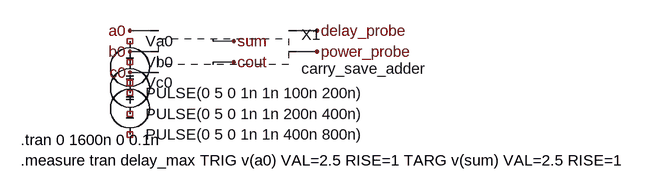
[diagram p0: schematic CARRY_SAVE_ADDER_TEST.asc]
CARRY_SAVE_ADDER_TEST.asc, the LTspice schematic file:
Version 4
SHEET 1 880 680
.lib .include "full_adder.asc"
.include "carry_save_adder.asc"
.include "ModelSp2025.txt"
* Input signals
WIRE 176 128 144 128
WIRE 176 160 144 160
WIRE 176 192 144 192
* Output probes
WIRE 304 144 272 144
WIRE 304 176 272 176
* Performance measurement points
WIRE 432 128 400 128
WIRE 432 160 400 160
FLAG 144 128 a0
FLAG 144 160 b0
FLAG 144 192 c0
FLAG 304 144 sum
FLAG 304 176 cout
FLAG 432 128 delay_probe
FLAG 432 160 power_probe
SYMBOL carry_save_adder 224 144 R0
SYMATTR InstName X1
* Input voltage sources with worst-case patterns
SYMBOL voltage 144 128 R0
WINDOW 123 0 0 Left 0
WINDOW 39 0 0 Left 0
SYMATTR InstName Va0
SYMATTR Value PULSE(0 5 0 1n 1n 100n 200n)
SYMBOL voltage 144 160 R0
WINDOW 123 0 0 Left 0
WINDOW 39 0 0 Left 0
SYMATTR InstName Vb0
SYMATTR Value PULSE(0 5 0 1n 1n 200n 400n)
SYMBOL voltage 144 192 R0
WINDOW 123 0 0 Left 0
WINDOW 39 0 0 Left 0
SYMATTR InstName Vc0
SYMATTR Value PULSE(0 5 0 1n 1n 400n 800n)
* Simulation directives for performance measurement
TEXT -24 296 Left 2 !.tran 0 1600n 0 0.1n
TEXT -24 328 Left 2 !.measure tran delay_max TRIG v(a0) VAL=2.5 RISE=1 TARG v(sum) VAL=2.5 RISE=1

The netlist it stands for:
* CARRY_SAVE_ADDER_TEST.asc
* X1: carry_save_adder (symbol carry_save_adder not available, pin order unknown); nets seen at it: a0, b0, c0, cout, delay_probe, power_probe, sum
Va0 NC_01 NC_02 PULSE(0 5 0 1n 1n 100n 200n)
Vb0 NC_03 NC_04 PULSE(0 5 0 1n 1n 200n 400n)
Vc0 NC_05 NC_06 PULSE(0 5 0 1n 1n 400n 800n)
.tran 0 1600n 0 0.1n
.measure tran delay_max TRIG v(a0) VAL=2.5 RISE=1 TARG v(sum) VAL=2.5 RISE=1
.backanno
.end